# Altium schematic sheet schematic.SchDoc
size A4; SheetNumber: 1; SheetTotal: 1
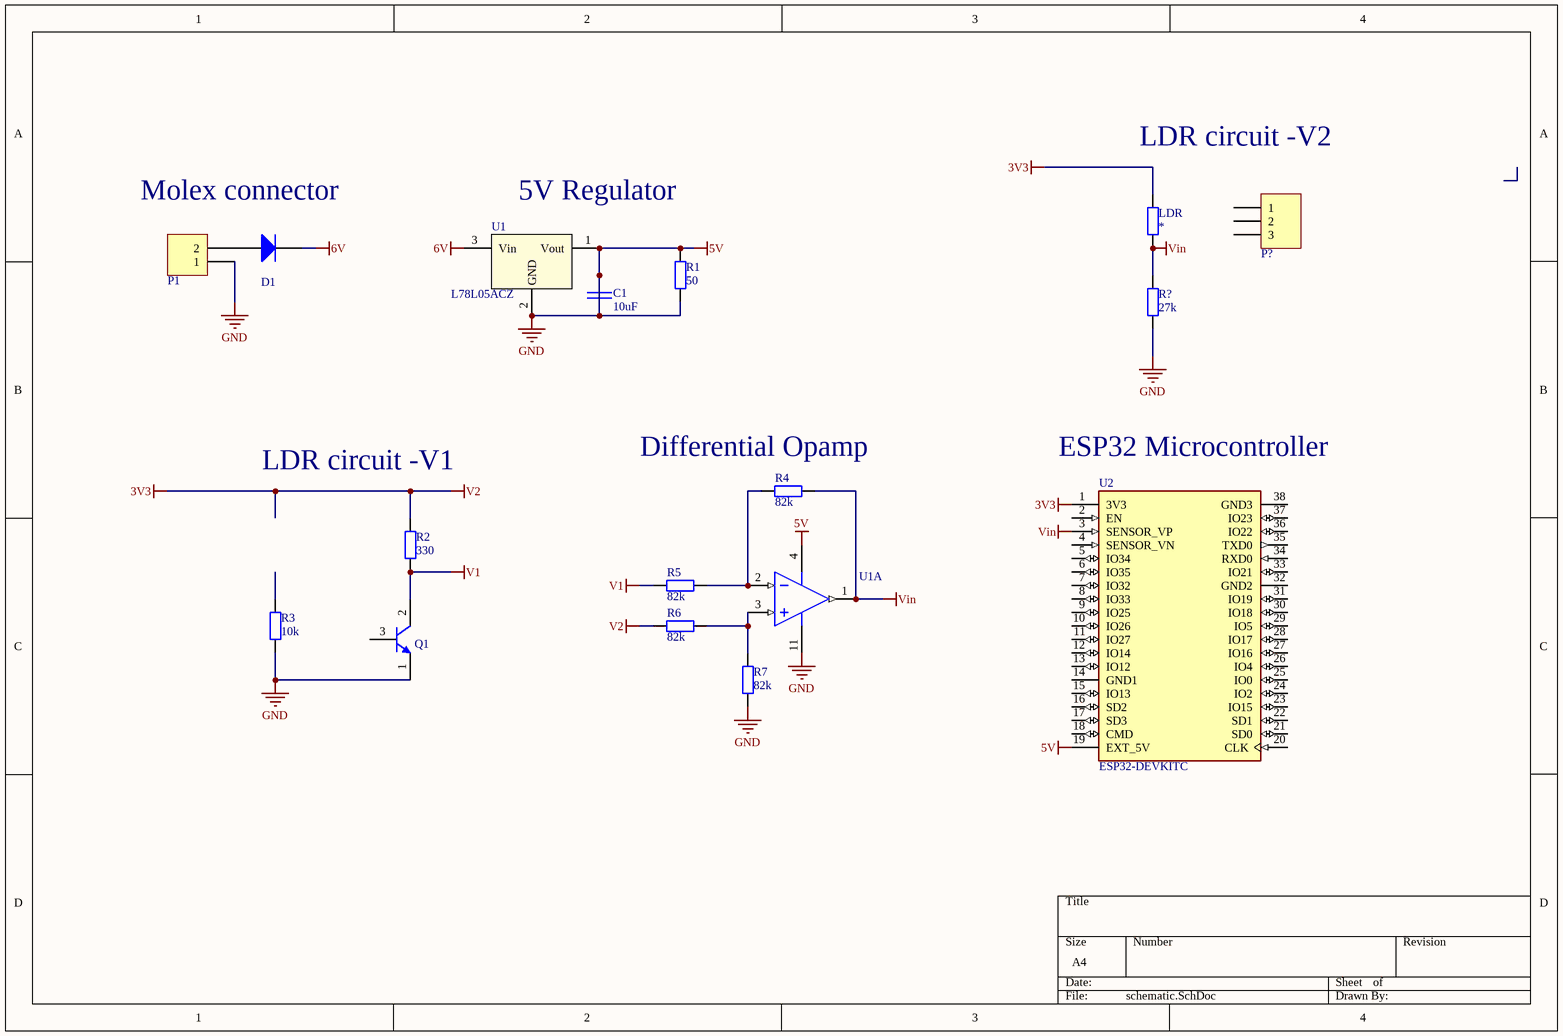
[diagram p0: schematic.SchDoc]

## Parts
(Parts that share a designator on the sheet are numbered #1, #2 ... from top to bottom, then left to right.)
C1  10uF  [CCAP-5P0]
D1  1N4007  [1N4007-MFG]  (value not drawn)
LDR  *  [AXIAL-0.4]
P1  2 Way  [ECE-600102STTH]  (value not drawn)
P?  3 Way  [ECE-600103STTH]  (value not drawn)
Q1  BD179G  [ECE-TO225TH]  (value not drawn)
R1  50  [AXIAL-0.4]
R2  330  [AXIAL-0.4]
R3  10k  [AXIAL-0.4]
R4  82k  [AXIAL-0.4]
R5  82k  [AXIAL-0.4]
R6  82k  [AXIAL-0.4]
R7  82k  [AXIAL-0.4]
R?  27k  [AXIAL-0.4]
U1#1  L78L05ACZ  [TO-92]
U1#2  LM324  [DIP-14]  (value not drawn)  (part A of 4)
U2  ESP32-DEVKITC  [MODULE_ESP32-DEVKITC]

## Nets
3V3: LDR.2 R2.2 R6.1 U2.1(3V3)  [also labelled V2]
5V: C1.1 C1.2 P1.1 Q1.1(E) R1.1 R1.2 R3.1 R7.1 R?.1 U1#1.1(Vout) U1#1.2(GND) U1#2.4(VDD) U1#2.11(VSS) U2.19(EXT_5V)  [also labelled GND]
6V: D1.2(K) U1#1.3(Vin)
V1: Q1.2(C) R2.1 R5.1
Vin: LDR.1 R4.2 R?.2 U1#2.1(VOUTA) U2.3(SENSOR_VP)
NetD1_1: D1.1(A) P1.2
NetR4_1: R4.1 R5.2 U1#2.2(VINA-)
NetR6_2: R6.2 R7.2 U1#2.3(VINA+)

Not connected (* = marked no-connect by the designer): P? 1 2 3; Q1 3(B); R3 2; U2 2(EN) 4(SENSOR_VN) 5(IO34) 6(IO35) 7(IO32) 8(IO33) 9(IO25) 10(IO26) 11(IO27) 12(IO14) 13(IO12) 14(GND1) 15(IO13) 16(SD2) 17(SD3) 18(CMD) 20(CLK) 21(SD0) 22(SD1) 23(IO15) 24(IO2) 25(IO0) 26(IO4) 27(IO16) 28(IO17) 29(IO5) 30(IO18) 31(IO19) 32(GND2) 33(IO21) 34(RXD0) 35(TXD0) 36(IO22) 37(IO23) 38(GND3)

## Notes on the sheet
- LDR circuit -V2
- Molex connector
- 5V Regulator
- LDR circuit -V1
- (near R4) Differential Opamp
- (near U2) ESP32 Microcontroller

## Library data of the parts
C1 = CerCap_TH_5P0: TH ceramic capacitor with 5mm pitch; Value: *
D1 = 1N4007_TH_4AX0: 1N4007 1000V standard axial diode; ComponentLink1URL: https://www.fairchildsemi.com/datasheets/1N/1N914.pdf; ComponentLink1Description: https://www.fairchildsemi.com/datasheets/1N/1N914.pdf; Supplier 1: Digi-Key; Supplier Part Number 1: 1N4007RLGOSCT-ND
LDR R1-R7 R? = Res_TH_0AX4: Through hole resistor; Published: 8-Jun-2000; LatestRevisionDate: 17-Jul-2002; LatestRevisionNote: Re-released for DXP Platform.; PackageReference: AXIAL-0.4; Publisher: Altium Limited; Value: *; ComponentLink1Description: http://www.royalohm.com/pdf/product2017/PrecisionMetalMF.pdf
P1 = CON000001: HEADER POLARISED 2WAY TH; Manufactuer: GTK; Manufacturer-PN: 600102ST; Assembly Method: Through hole; Item Type: Item; Path: ece/ts/Lists/Stock Inventory; UoA Stock#: CON000001; Value: 2 Way; Size/Package: 2.54 Radial; Datasheet Link: http://share.engineering.auckland.ac.nz/ece/ts/Student%20Documents/polarised_connectors.pdf; Supplier1: Elecon; Supplier1-PN: YY3N02; Supplier2: Active Components; Supplier2-PN: 600102ST; Component Type: NA; Category: Connector; Status: Active
P? = CON000002: HEADER POLARISED 3WAY TH; Manufactuer: GTK; Manufacturer-PN: 600103ST; Assembly Method: Through hole; Item Type: Item; Path: ece/ts/Lists/Stock Inventory; UoA Stock#: CON000002; Value: 3 Way; Size/Package: 2.54 Radial; Datasheet Link: http://share.engineering.auckland.ac.nz/ece/ts/Student%20Documents/polarised_connectors.pdf; Supplier1: Elecon; Supplier1-PN: YY3N03; Supplier2: Active Components; Supplier2-PN: 600103ST; Component Type: NA; Category: Connector; Status: Active
Q1 = TRA000002: BD179G NPN Transistor TH; Manufactuer: ON SEMICONDUCTOR; Voltage/Current: 80V/1A; Assembly Method: Through hole; Item Type: Item; Path: ece/ts/Lists/Stock Inventory; Value: BD179G; UoA Stock#: TRA000002; Size/Package: TO-225; Manufacturer-PN: BD179G; Datasheet Link: http://share.engineering.auckland.ac.nz/ece/ts/Student%20Documents/BD179-D.PDF; Supplier1: Element14; Supplier1-PN: 9557059; Component Type: NA; Category: Transistor; Status: Active
U1#1 = L78L05_TH_TO92: Voltage Regulator 5V; Manufacturer: ON Semiconductor; Manufacturer Part Number: LM78L05ACZX; Output Configuration: Positive; Output Type: Fixed; Voltage - Input (Max): 30V; Current - Output: 100mA; PSRR: 80dB (120Hz); Protection Features: Over Temperature, Short Circuit; Supplier 1: Digi-Key; RoHS: RoHS Compliant; Category: Integrated Circuits (ICs); Stock 1: 7782; Pricing 1: 1=0.69, 10=0.517, 100=0.3226, 500=0.2207, 1000=0.16976 (NZD); Packaging: Cut Tape (CT); Part Status: Active; Voltage - Output (Min/Fixed): 5V; Voltage - Output (Max): -; Voltage Dropout (Max): -; Control Features: -; Operating Temperature: -40°C ~ 125°C; Mounting Type: Through Hole; Package / Case: TO-226-3, TO-92-3 (TO-226AA) (Formed Leads); Supplier Device Package: TO-92-3; Base Part Number: LM78L05; ComponentLink1URL: https://www.fairchildsemi.com/datasheets/MC/MC78L05A.pdf; ComponentLink1Description: https://www.fairchildsemi.com/datasheets/MC/MC78L05A.pdf; Supplier Part Number 1: LM78L05ACZXCT-ND
U1#2 = LM324N_TH_DIP16: IC OPAMP GP 14DIP; Manufacturer: ON Semiconductor; Manufacturer Part Number: LM324N; Amplifier Type: General Purpose; Current - Supply: 1mA; Voltage - Supply, Single/Dual (±): 3 V ~ 32 V, ±1.5 V ~ 16 V; Supplier 1: Digi-Key; RoHS: RoHS Compliant; Category: Integrated Circuits (ICs); Stock 1: 2900; Pricing 1: 1=0.9, 10=0.775, 100=0.5789, 500=0.45482, 1000=0.35145 (NZD); Packaging: Tube; Part Status: Active; Output Type: -; Slew Rate: -; Operating Temperature: 0°C ~ 70°C; Mounting Type: Through Hole; Package / Case: 14-DIP (0.300", 7.62mm); Supplier Device Package: 14-DIP; Base Part Number: LM324; ComponentLink1URL: https://www.fairchildsemi.com/datasheets/LM/LM2902.pdf; ComponentLink1Description: https://www.fairchildsemi.com/datasheets/LM/LM2902.pdf; Supplier Part Number 1: LM324NFS-ND
U2 = ESP32-DEVKITC: ESP32-WROOM-32UE series Transceiver; 802.11 b/g/n (Wi-Fi, WiFi, WLAN), Bluetooth Â® Smart Ready 4.x Dual Mode Evaluation Board; MF: Espressif Systems; SnapEDA_Link: https://www.snapeda.com/parts/ESP32-DEVKITC/Espressif+Systems/view-part/?ref=snap; Package: None; Value: *; MP: ESP32-DEVKITC; Check_prices: https://www.snapeda.com/parts/ESP32-DEVKITC/Espressif+Systems/view-part/?ref=eda